# Altium project STM32G474QE开发板.PrjPcb
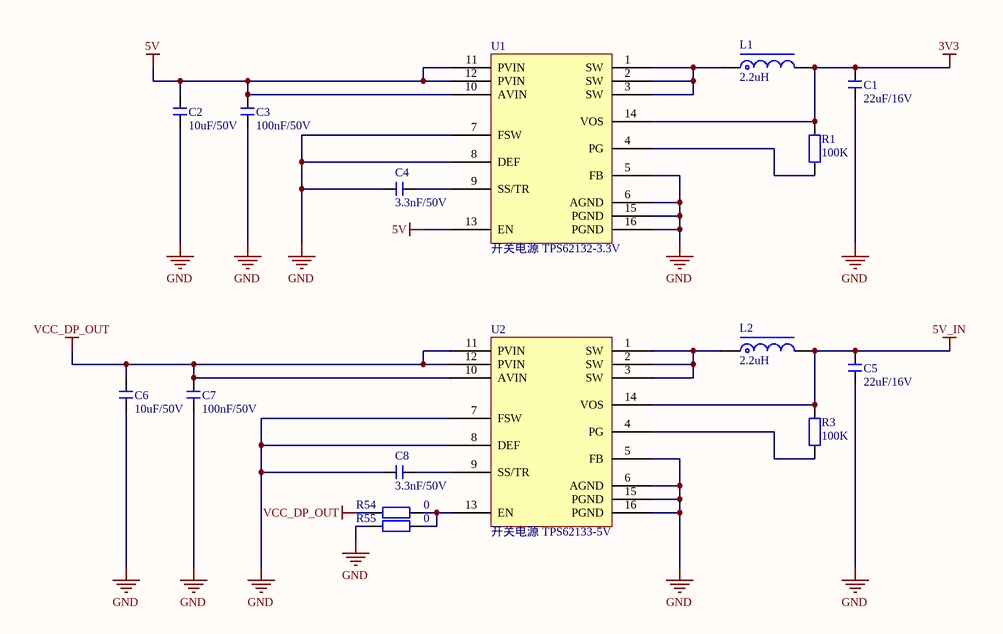
[diagram p0: POW.SchDoc]
5 sheets, 124 parts. Net scope: global (net labels, ports and power ports of the same name join across sheets).
Board file: PCB2.PcbDoc
Sheets:
  POW.SchDoc
  POW_MCU.SchDoc
  Main.SchDoc
  Debug.SchDoc
  PD_USB.SchDoc

## Sheet POW.SchDoc
size A4; SheetNumber: 1; SheetTotal: 5

### Parts
C1  22uF/16V  [C 0805_L]
C2  10uF/50V  [C 0805_L]
C3  100nF/50V  [C 0603_L]
C4  3.3nF/50V  [C 0402_L]
C5  22uF/16V  [C 0805_L]
C6  10uF/50V  [C 0805_L]
C7  100nF/50V  [C 0603_L]
C8  3.3nF/50V  [C 0402_L]
L1  2.2uH  [电感XFL4020]
L2  2.2uH  [电感XFL4020]
R1  100K  [R 0402_L]
R3  100K  [R 0402_L]
R54  0  [R 0402_L]
R55  0  [R 0402_L]
U1  开关电源 TPS62132-3.3V  [QFN16]
U2  开关电源 TPS62133-5V  [QFN16]

### Nets
3V3: C1.1 L1.2 R1.2 U1.14(VOS)
5V: C2.2 C3.2 U1.10(AVIN) U1.11(PVIN) U1.12(PVIN) U1.13(EN)
5V_IN: C5.1 L2.2 R3.1 U2.14(VOS)
GND: C1.2 C2.1 C3.1 C4.1 C5.2 C6.1 C7.1 C8.1 R55.1 U1.5(FB) U1.6(AGND) U1.7(FSW) U1.8(DEF) U1.15(PGND) U1.16(PGND) U2.5(FB) U2.6(AGND) U2.7(FSW) U2.8(DEF) U2.15(PGND) U2.16(PGND)
VCC_DP_OUT: C6.2 C7.2 R54.1 U2.10(AVIN) U2.11(PVIN) U2.12(PVIN)
NetC4_2: C4.2 U1.9(SS/TR)
NetC8_2: C8.2 U2.9(SS/TR)
NetL1_1: L1.1 U1.1(SW) U1.2(SW) U1.3(SW)
NetL2_1: L2.1 U2.1(SW) U2.2(SW) U2.3(SW)
NetR1_1: R1.1 U1.4(PG)
NetR3_2: R3.2 U2.4(PG)
NetR54_2: R54.2 R55.2 U2.13(EN)

### Library data of the parts
C1 C5 = C: 贴片电容; 主类型: 电容; 值精度: ±10%; 元件封装: 0805; 具体类型: 陶瓷电容; 封装类型: 贴片; 温度漂移: X7R（10%）; 温度范围: -55°C ~ 125°C; 生产商: SAMSUNG(三星); 生产商零件编码: CL21A226KOQNNNE; 值/型号: 22uF/16V; 立创编号: C296720
C2 C6 = C: 贴片电容; 主类型: 电容; 值精度: ±10%; 元件封装: 0805; 具体类型: 陶瓷电容; 封装类型: 贴片; 温度漂移: X5R; 温度范围: -55°C ~ 125°C; 生产商: muRata(村田); 生产商零件编码: GRM21BR61H106KE43L; 值/型号: 10uF/50V; 立创编号: C440198
C3 C7 = C: 贴片电容; 主类型: 电容; 值精度: ±10%; 元件封装: 0603; 具体类型: 陶瓷电容; 封装类型: 贴片; 温度漂移: X7R（15%）; 温度范围: -55°C ~ 125°C; 生产商: SAMSUNG(三星); 生产商零件编码: CL10B104KB8NNNC; 值/型号: 100nF/50V; 立创编号: C1590
C4 C8 = C: 贴片电容; 主类型: 电容; 值精度: ±5%; 元件封装: 0402; 具体类型: 陶瓷电容; 封装类型: 贴片; 温度漂移: X7R（5%）; 温度范围: -55°C ~ 125°C; 生产商: YAGEO(国巨); 生产商零件编码: CC0402JRX7R9BB332; 值/型号: 3.3nF/50V; 立创编号: C541447
L1 L2 = L-CD: XFL4020-222MEB; 主类型: 电感; 元件封装: 4020; 具体类型: 功率电感; 封装类型: 贴片; 温度范围: -40-125; 生产商: Coilcraft; 类型备注: 淘宝采购; 值/型号: XFL4020-222MEB; 生产商零件编码: XFL4020-222MEB; 立创编号: https://detail.tmall.com/item.htm?spm=a230r.1.14.16.717a6f292tX0SR&id=619184428761&ns=1&abbucket=12
R1 R3 = R: 贴片电阻 0402 1%; 主类型: 电阻; 元件封装: 0402; 封装类型: 贴片; 温度漂移: ±100ppm/℃; 生产商: 国巨; 生产商零件编码: RC0402FR-07100KL; 值/型号: 100K; 值精度: ±1%; 具体类型: 贴片电阻; 立创编号: C60491
R54 R55 = R: 贴片电阻; 元件封装: 0402; 封装类型: 贴片
U1 U2 = 开关电源 TPS62133: 主类型: 线性稳压器; 值/型号: TPS62133RGTR; 元件封装: VQFN-16; 具体类型: LDO; 封装类型: 贴片; 温度范围: -40-85; 生产商: TI(德州仪器); 生产商零件编码: TPS62133RGTR; 立创编号: C73973

## Sheet POW_MCU.SchDoc
size A4; SheetNumber: 2; SheetTotal: 5
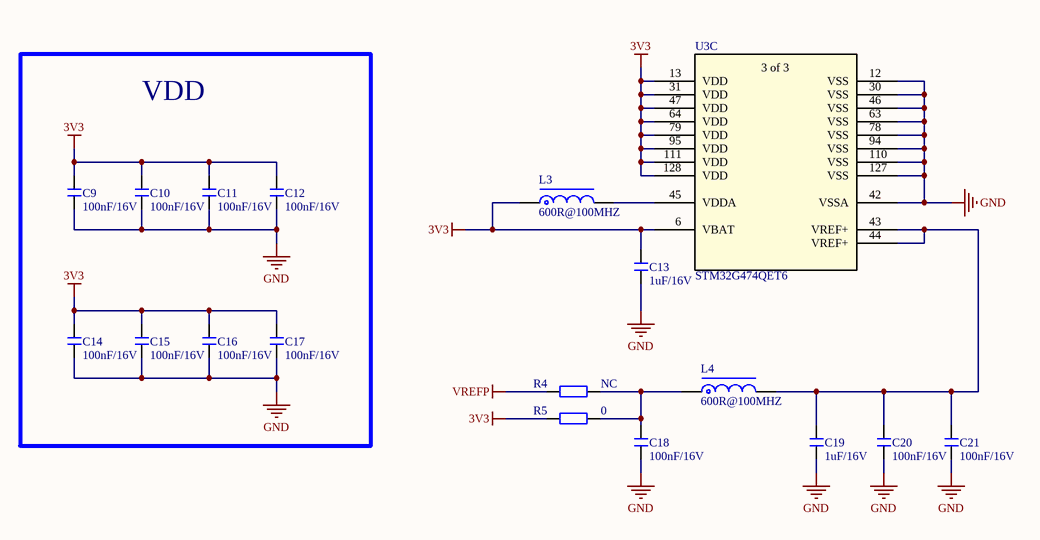
[diagram p1: POW_MCU.SchDoc]

### Parts
C9  100nF/16V  [C 0402_L]
C10  100nF/16V  [C 0402_L]
C11  100nF/16V  [C 0402_L]
C12  100nF/16V  [C 0402_L]
C13  1uF/16V  [C 0402_L]
C14  100nF/16V  [C 0402_L]
C15  100nF/16V  [C 0402_L]
C16  100nF/16V  [C 0402_L]
C17  100nF/16V  [C 0402_L]
C18  100nF/16V  [C 0402_L]
C19  1uF/16V  [C 0402_L]
C20  100nF/16V  [C 0402_L]
C21  100nF/16V  [C 0402_L]
L3  600R@100MHZ  [L 0603]
L4  600R@100MHZ  [L 0603]
R4  NC  [R 0402_L]
R5  0  [R 0402_L]
U3  STM32G474QET6  [LQFP128 14x14_L]  (part C of 3)

### Blocks framed on the sheet
VDD: C9-C12 C14-C17

### Nets
3V3: C9.2 C10.2 C11.2 C12.2 C13.1 C14.2 C15.2 C16.2 C17.2 L3.1 R5.1 U3.6(VBAT) U3.13(VDD) U3.31(VDD) U3.47(VDD) U3.64(VDD) U3.79(VDD) U3.95(VDD) U3.111(VDD) U3.128(VDD)
GND: C9.1 C10.1 C11.1 C12.1 C13.2 C14.1 C15.1 C16.1 C17.1 C18.1 C19.2 C20.1 C21.1 U3.12(VSS) U3.30(VSS) U3.42(VSSA) U3.46(VSS) U3.63(VSS) U3.78(VSS) U3.94(VSS) U3.110(VSS) U3.127(VSS)
VREFP: R4.1
NetC18_2: C18.2 L4.1 R4.2 R5.2
NetC19_1: C19.1 C20.2 C21.2 L4.2 U3.43(VREF+) U3.44(VREF+)
NetL3_2: L3.2 U3.45(VDDA)

### Notes on the sheet
- (in symbol STM32G474QET6, part C) 3 of 3

### Library data of the parts
C9-C12 C14-C18 C20 C21 = C: 贴片电容; 主类型: 电容; 值精度: ±10%; 元件封装: 0402; 具体类型: 陶瓷电容; 封装类型: 贴片; 温度漂移: X7R（15%）; 温度范围: -55°C ~ 125°C; 生产商: YAGEO(国巨); 生产商零件编码: CC0402KRX7R7BB104; 值/型号: 100nF/16V; 立创编号: C60474
C13 C19 = C: 贴片电容; 主类型: 电容; 值精度: ±10%; 元件封装: 0402; 具体类型: 陶瓷电容; 封装类型: 贴片; 温度漂移: X7R（5%）; 温度范围: -55°C ~ 125°C; 生产商: SAMSUNG(三星); 生产商零件编码: CL05A105KO5NNNC; 值/型号: 1uF/16V; 立创编号: C29266
L3 L4 = L-CD: XFL4020-222MEB; 主类型: 电感; 值/型号: FCM1608KF-601T03; 元件封装: 0603; 具体类型: 磁珠; 封装类型: 贴片; 温度范围: -40-125; 生产商: 台庆; 生产商零件编码: FCM1608KF-601T03; 立创编号: C141723
R4 R5 = R: 贴片电阻; 元件封装: 0402; 封装类型: 贴片
U3 = STM32G474QET6: No Description Available; Vendor: STMicroelectronics; Built_By: EMA_UL_Team; SourceLibrary: Updates_to_database_2020-10-19; Manufacturer_Part_Number: STM32G474QET6; Copyright: Copyright (C) 2018 Accelerated Designs. All rights reserved; RefDes: RefDes; Type: DEV

## Sheet Main.SchDoc
size A3; SheetNumber: 3; SheetTotal: 5
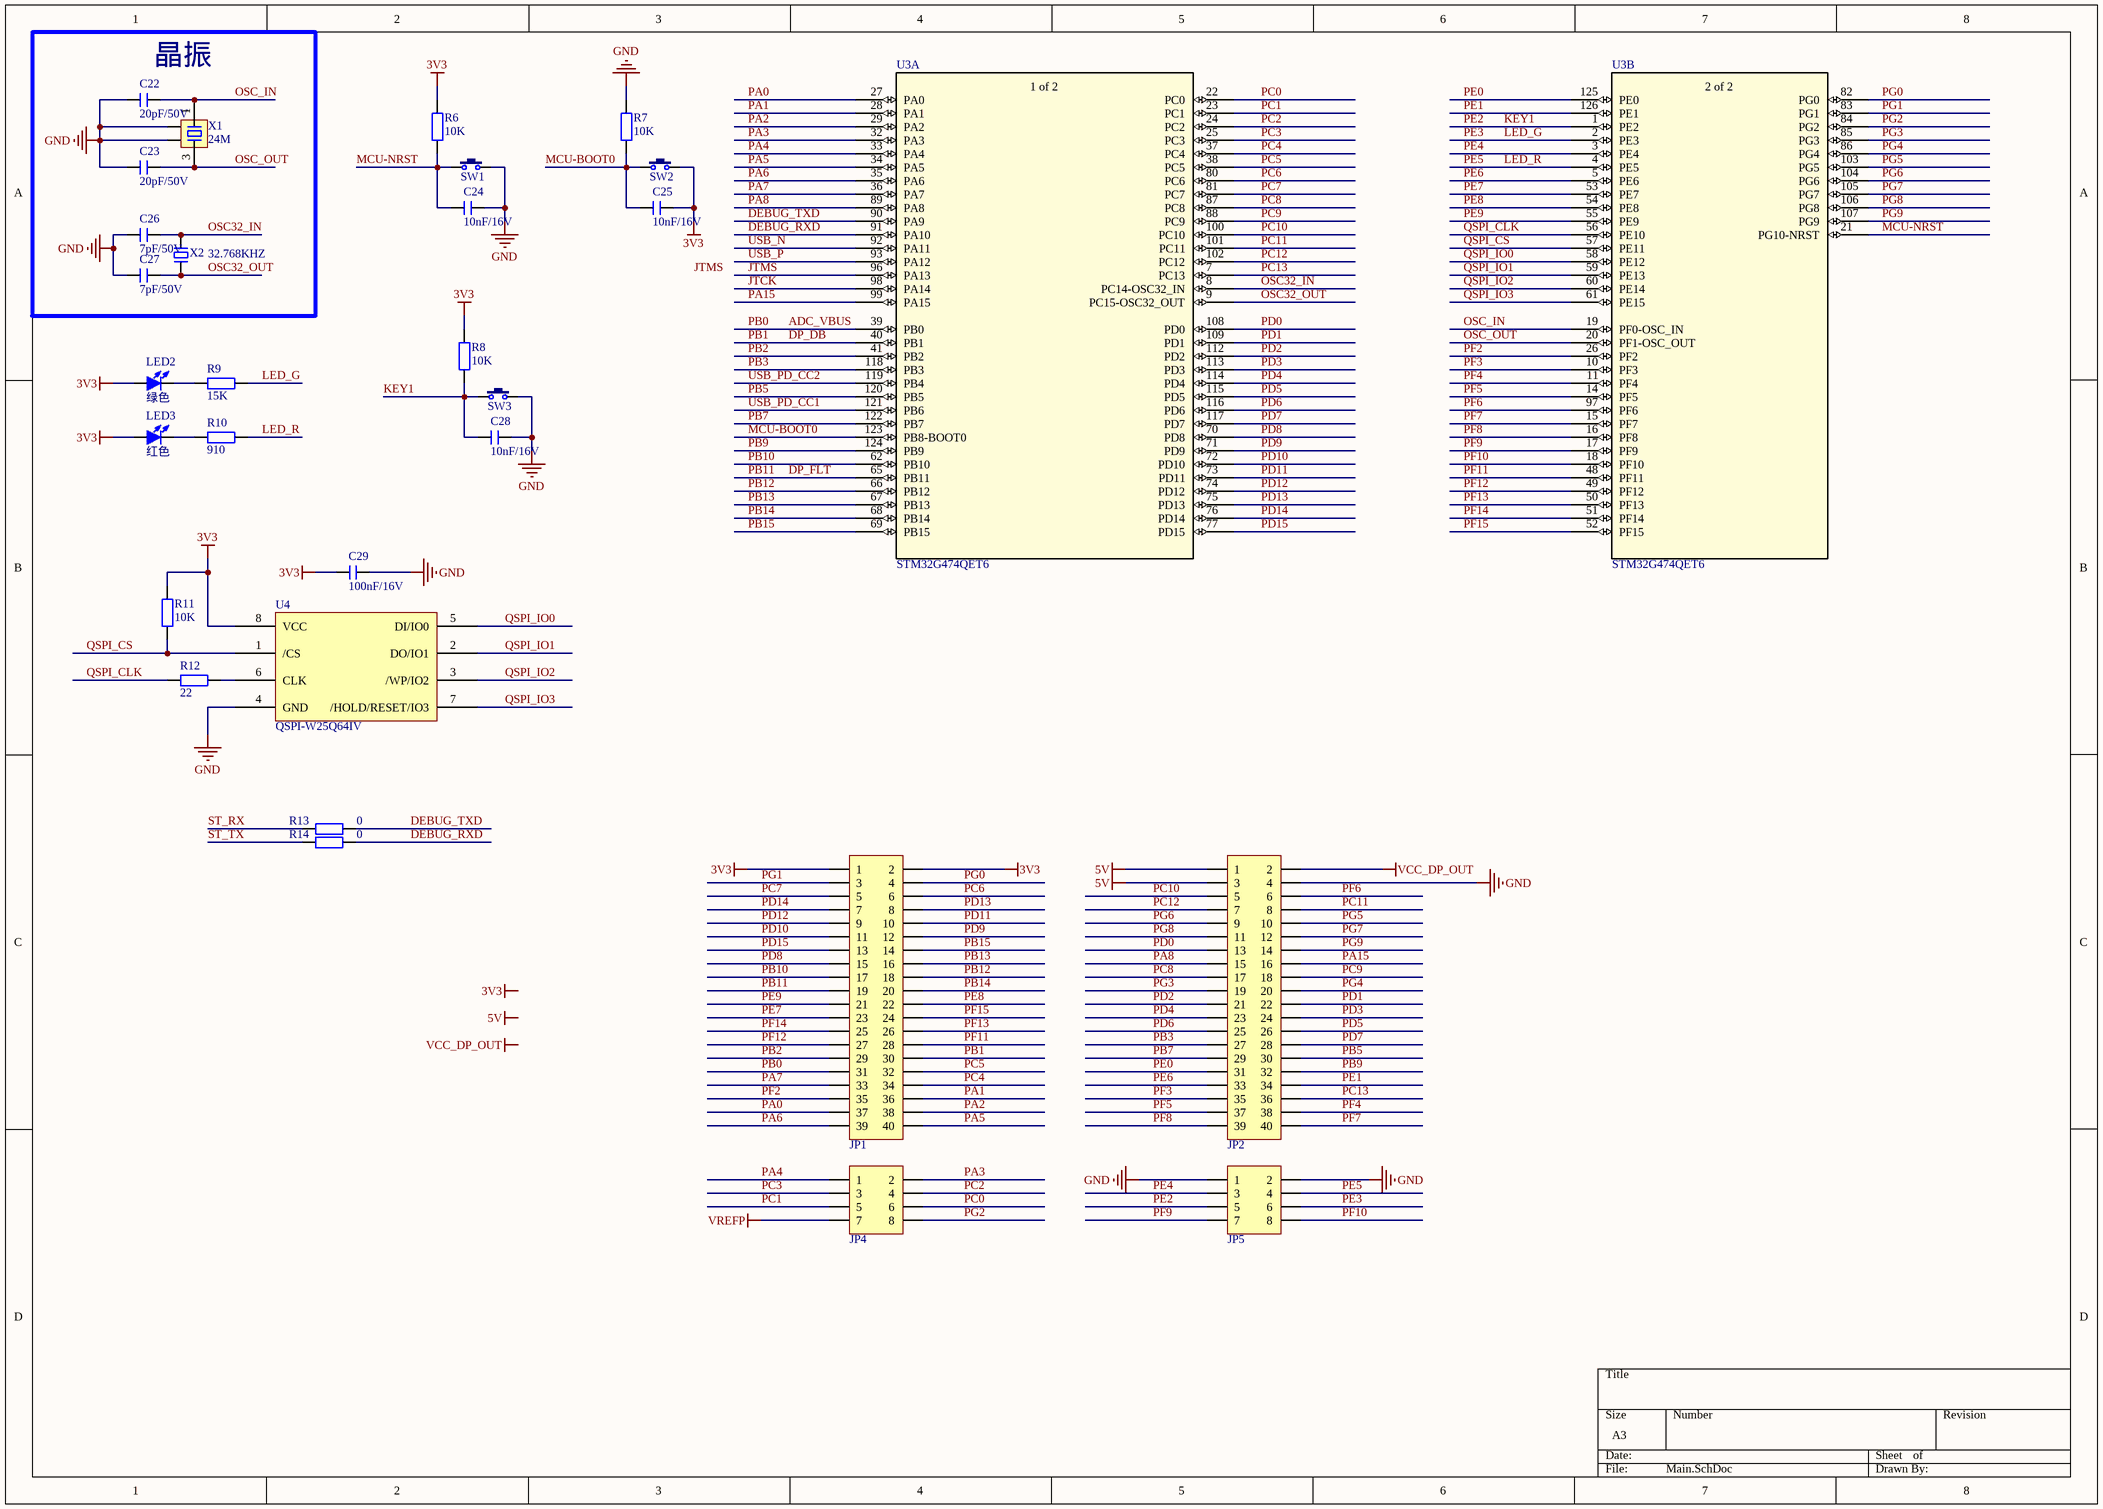
[diagram p2: Main.SchDoc]

### Parts
C22  20pF/50V  [C 0402_L]
C23  20pF/50V  [C 0402_L]
C24  10nF/16V  [C 0402_L]
C25  10nF/16V  [C 0402_L]
C26  7pF/50V  [C 0402_L]
C27  7pF/50V  [C 0402_L]
C28  10nF/16V  [C 0402_L]
C29  100nF/16V  [C 0402_L]
JP1  Header 2X11  [HDR2.54-LI-2x20P]  (value not drawn)
JP2  Header 2X11  [HDR2.54-LI-2x20P]  (value not drawn)
JP4  Header 4X2  [HDR2.54-LI-2x4P]  (value not drawn)
JP5  Header 4X2  [HDR2.54-LI-2x4P]  (value not drawn)
LED2  绿色  [LED]
LED3  红色  [LED]
R6  10K  [R 0402_L]
R7  10K  [R 0402_L]
R8  10K  [R 0402_L]
R9  15K  [R 0402_L]
R10  910  [R 0402_L]
R11  10K  [R 0402_L]
R12  22  [R 0402_L]
R13  0  [R 0402_L]
R14  0  [R 0402_L]
SW1  3x6x5  [按钮]  (value not drawn)
SW2  3x6x5  [按钮]  (value not drawn)
SW3  3x6x5  [按钮]  (value not drawn)
U3  STM32G474QET6  [LQFP128 14x14_L]  (parts A,B of 3)
U4  QSPI-W25Q64IV  [QSPI]
X1  24M  [OSC 3225-4P]
X2  32.768KHZ  [OSC 3215-2P]

### Blocks framed on the sheet
晶振: C22 C23 C26 C27 X1 X2

### Nets
3V3: C25.2 C29.2 JP1.1 JP1.2 LED2.1(A) LED3.1(A) R6.2 R8.2 R11.1 SW2.2 U4.8(VCC)
5V: JP2.1 JP2.3
GND: C22.1 C23.1 C24.2 C26.1 C27.1 C28.2 C29.1 JP2.4 JP5.1 JP5.2 R7.2 SW1.2 SW3.2 U4.4(GND) X1.2 X1.4
VCC_DP_OUT: JP2.2
VREFP: JP4.7
ADC_VBUS: JP1.31 U3.39(PB0)  [also labelled PB0]
DEBUG_RXD: R14.2 U3.91(PA10)
DEBUG_TXD: R13.2 U3.90(PA9)
DP_DB: JP1.30 U3.40(PB1)  [also labelled PB1]
DP_FLT: JP1.19 U3.65(PB11)  [also labelled PB11]
JTCK: U3.98(PA14)
JTMS: U3.96(PA13)
KEY1: C28.1 JP5.5 R8.1 SW3.1 U3.1(PE2)  [also labelled PE2]
LED_G: JP5.6 R9.1 U3.2(PE3)  [also labelled PE3]
LED_R: JP5.4 R10.1 U3.4(PE5)  [also labelled PE5]
MCU-BOOT0: C25.1 R7.1 SW2.1 U3.123(PB8-BOOT0)
MCU-NRST: C24.1 R6.1 SW1.1 U3.21(PG10-NRST)
OSC32_IN: C26.2 U3.8(PC14-OSC32_IN) X2.2
OSC32_OUT: C27.2 U3.9(PC15-OSC32_OUT) X2.1
OSC_IN: C22.2 U3.19(PF0-OSC_IN) X1.1
OSC_OUT: C23.2 U3.20(PF1-OSC_OUT) X1.3
PA0: JP1.37 U3.27(PA0)
PA1: JP1.36 U3.28(PA1)
PA2: JP1.38 U3.29(PA2)
PA3: JP4.2 U3.32(PA3)
PA4: JP4.1 U3.33(PA4)
PA5: JP1.40 U3.34(PA5)
PA6: JP1.39 U3.35(PA6)
PA7: JP1.33 U3.36(PA7)
PA8: JP2.15 U3.89(PA8)
PA15: JP2.16 U3.99(PA15)
PB2: JP1.29 U3.41(PB2)
PB3: JP2.27 U3.118(PB3)
PB5: JP2.30 U3.120(PB5)
PB7: JP2.29 U3.122(PB7)
PB9: JP2.32 U3.124(PB9)
PB10: JP1.17 U3.62(PB10)
PB12: JP1.18 U3.66(PB12)
PB13: JP1.16 U3.67(PB13)
PB14: JP1.20 U3.68(PB14)
PB15: JP1.14 U3.69(PB15)
PC0: JP4.6 U3.22(PC0)
PC1: JP4.5 U3.23(PC1)
PC2: JP4.4 U3.24(PC2)
PC3: JP4.3 U3.25(PC3)
PC4: JP1.34 U3.37(PC4)
PC5: JP1.32 U3.38(PC5)
PC6: JP1.6 U3.80(PC6)
PC7: JP1.5 U3.81(PC7)
PC8: JP2.17 U3.87(PC8)
PC9: JP2.18 U3.88(PC9)
PC10: JP2.5 U3.100(PC10)
PC11: JP2.8 U3.101(PC11)
PC12: JP2.7 U3.102(PC12)
PC13: JP2.36 U3.7(PC13)
PD0: JP2.13 U3.108(PD0)
PD1: JP2.22 U3.109(PD1)
PD2: JP2.21 U3.112(PD2)
PD3: JP2.24 U3.113(PD3)
PD4: JP2.23 U3.114(PD4)
PD5: JP2.26 U3.115(PD5)
PD6: JP2.25 U3.116(PD6)
PD7: JP2.28 U3.117(PD7)
PD8: JP1.15 U3.70(PD8)
PD9: JP1.12 U3.71(PD9)
PD10: JP1.11 U3.72(PD10)
PD11: JP1.10 U3.73(PD11)
PD12: JP1.9 U3.74(PD12)
PD13: JP1.8 U3.75(PD13)
PD14: JP1.7 U3.76(PD14)
PD15: JP1.13 U3.77(PD15)
PE0: JP2.31 U3.125(PE0)
PE1: JP2.34 U3.126(PE1)
PE4: JP5.3 U3.3(PE4)
PE6: JP2.33 U3.5(PE6)
PE7: JP1.23 U3.53(PE7)
PE8: JP1.22 U3.54(PE8)
PE9: JP1.21 U3.55(PE9)
PF2: JP1.35 U3.26(PF2)
PF3: JP2.35 U3.10(PF3)
PF4: JP2.38 U3.11(PF4)
PF5: JP2.37 U3.14(PF5)
PF6: JP2.6 U3.97(PF6)
PF7: JP2.40 U3.15(PF7)
PF8: JP2.39 U3.16(PF8)
PF9: JP5.7 U3.17(PF9)
PF10: JP5.8 U3.18(PF10)
PF11: JP1.28 U3.48(PF11)
PF12: JP1.27 U3.49(PF12)
PF13: JP1.26 U3.50(PF13)
PF14: JP1.25 U3.51(PF14)
PF15: JP1.24 U3.52(PF15)
PG0: JP1.4 U3.82(PG0)
PG1: JP1.3 U3.83(PG1)
PG2: JP4.8 U3.84(PG2)
PG3: JP2.19 U3.85(PG3)
PG4: JP2.20 U3.86(PG4)
PG5: JP2.10 U3.103(PG5)
PG6: JP2.9 U3.104(PG6)
PG7: JP2.12 U3.105(PG7)
PG8: JP2.11 U3.106(PG8)
PG9: JP2.14 U3.107(PG9)
QSPI_CLK: R12.1 U3.56(PE10)
QSPI_CS: R11.2 U3.57(PE11) U4.1(/CS)
QSPI_IO0: U3.58(PE12) U4.5(DI/IO0)
QSPI_IO1: U3.59(PE13) U4.2(DO/IO1)
QSPI_IO2: U3.60(PE14) U4.3(/WP/IO2)
QSPI_IO3: U3.61(PE15) U4.7(/HOLD/RESET/IO3)
ST_RX: R13.1
ST_TX: R14.1
USB_N: U3.92(PA11)
USB_P: U3.93(PA12)
USB_PD_CC1: U3.121(PB6)
USB_PD_CC2: U3.119(PB4)
NetLED2_2: LED2.2(K) R9.2
NetLED3_2: LED3.2(K) R10.2
NetR12_2: R12.2 U4.6(CLK)

### Notes on the sheet
- Labels drawn without touching a wire or pin: 3V3, 5V, JTMS, VCC_DP_OUT
- (in symbol STM32G474QET6, part A) 1 of 2
- (in symbol STM32G474QET6, part B) 2 of 2

### Library data of the parts
C22 C23 = C: 贴片电容; 主类型: 电容; 值精度: ±1%; 元件封装: 0402; 具体类型: 陶瓷电容; 封装类型: 贴片; 温度漂移: NP0; 生产商: YAGEO(国巨); 生产商零件编码: CC0402FRNPO9BN200; 值/型号: 20pF/50V; 立创编号: C327010
C24 C25 C28 = C: 贴片电容; 主类型: 电容; 值精度: ±10%; 元件封装: 0402; 具体类型: 陶瓷电容; 封装类型: 贴片; 温度漂移: X7R; 生产商: YAGEO(国巨); 生产商零件编码: CC0402KRX7R7BB103; 值/型号: 10nF/16V; 立创编号: C327009
C26 C27 = C: 贴片电容; 主类型: 电容; 值精度: ±0.25pF; 元件封装: 0402; 具体类型: 陶瓷电容; 封装类型: 贴片; 温度漂移: C0G; 生产商: YAGEO(国巨); 生产商零件编码: CC0402CRNPO9BN7R0; 值/型号: 7pF/50V; 立创编号: C260628
C29 = C: as C9 on sheet POW_MCU; 值/型号: 100nF/16V; 立创编号: C60474
JP1 JP2 = Header 20X2: 20*2P接插件; 版权归属: 源创客; BOM名称: 20*2P接插件; 学习资源: www.ooocke.com
JP4 JP5 = Header 4X2: 4*2P接插件; 版权归属: 源创客; BOM名称: 4*2P接插件; 学习资源: www.ooocke.com
LED2 LED3 = LED-SMD: C84267
R6-R8 = R: 贴片电阻
R9 = R: 贴片电阻 0402 5%; 主类型: 电阻; 值精度: ±1%; 元件封装: 0402; 封装类型: 贴片; 温度漂移: 50ppm; 生产商: 国巨; 生产商零件编码: RT0402FRE0715KL; 值/型号: 15K; 具体类型: 贴片电阻; 立创编号: C136975
R10 = R: 贴片电阻 0402 5%; 主类型: 电阻; 值/型号: 15K; 值精度: ±1%; 元件封装: 0402; 封装类型: 贴片; 温度漂移: 50ppm; 生产商: 国巨; 生产商零件编码: RT0402FRE0715KL; 具体类型: 贴片电阻; 立创编号: C136975
R11 R12 = R: 贴片电阻 0402 1%; 主类型: 电阻; 值/型号: 100K; 元件封装: 0402; 封装类型: 贴片; 温度漂移: ±100ppm/℃; 生产商: 国巨; 生产商零件编码: RC0402FR-07100KL; 值精度: ±1%; 具体类型: 贴片电阻; 立创编号: C60491
R13 R14 = R: 贴片电阻; 元件封装: 0402; 封装类型: 贴片
SW1-SW3 = TSW 3x6: 3x6轻触开关
U3 = STM32G474QET6: as U3 on sheet POW_MCU; Manufacturer_Part_Number: STM32G474QET6; Copyright: Copyright (C) 2018 Accelerated Designs. All rights reserved; RefDes: RefDes; Type: DEV
U4 = QSPI-W25Q256IV
X1 = XTAL-4P: 4脚无源晶振; 主类型: 晶振; 值精度: 20PPM; 元件封装: 3225; 具体类型: 无源晶振; 封装类型: 贴片; 温度范围: -40℃~85℃; 生产商: YXC扬兴科技; 生产商零件编码: X322524MSB4SI; 值/型号: 24M; 立创编号: C15643
X2 = XTAL-2P: 2脚无源脚晶振; 主类型: 晶振; 值精度: 10PPM; 元件封装: 3215; 具体类型: 无源晶振; 封装类型: 贴片; 温度范围: -40℃ ~ +85℃; 生产商: EPSON(爱普生); 生产商零件编码: Q13FC1350000200; 值/型号: 32.768K; 立创编号: C48615

## Sheet Debug.SchDoc
size A3; SheetNumber: 4; SheetTotal: 5
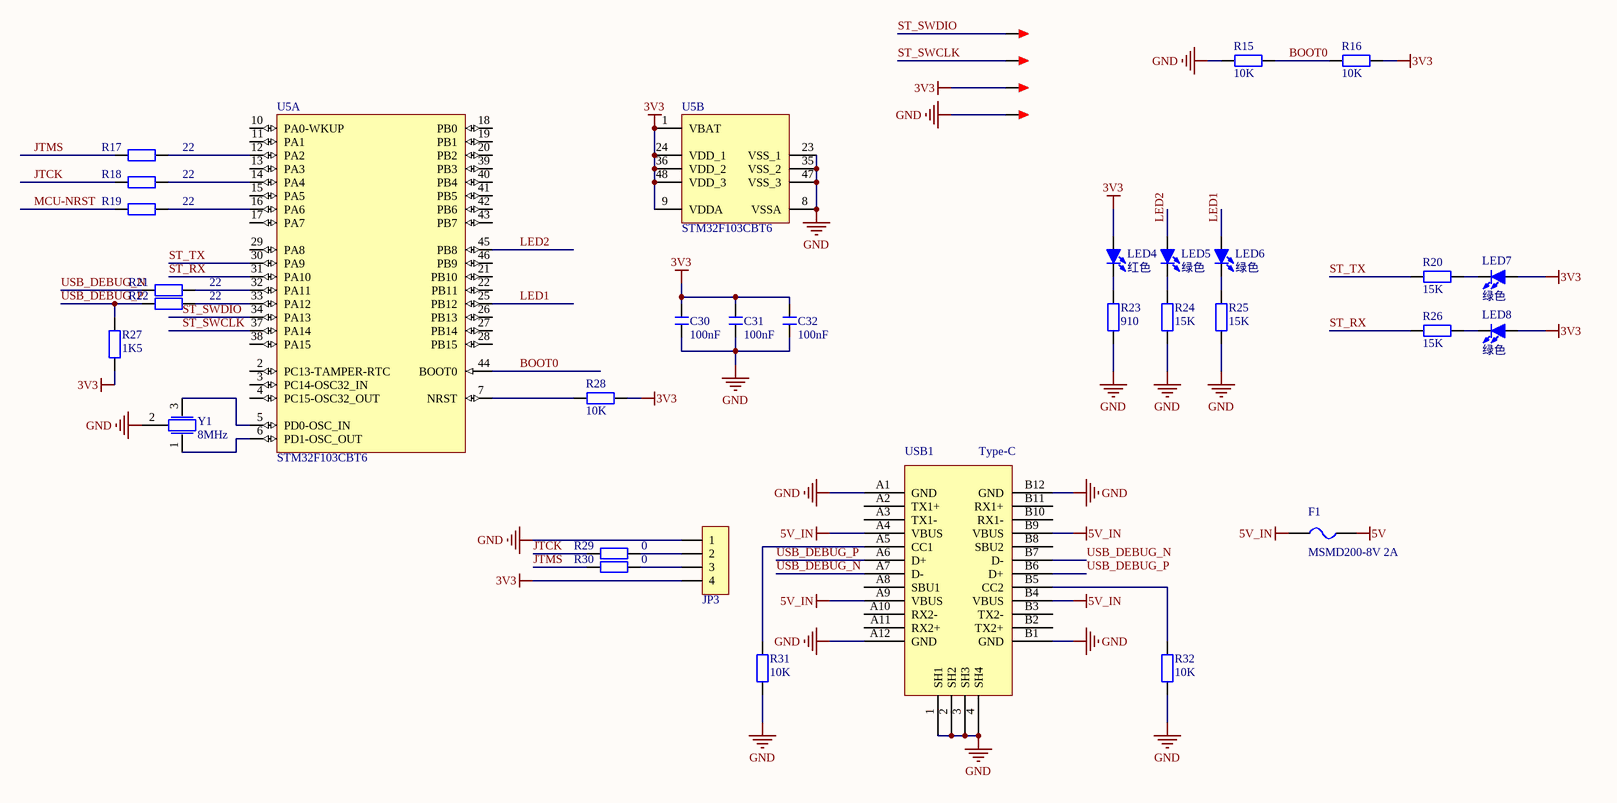
[diagram p3: Debug.SchDoc]

### Parts
C30  100nF  [C 0402_L]
C31  100nF  [C 0402_L]
C32  100nF  [C 0402_L]
F1  MSMD200-8V 2A  [FU 0603]
JP3  HDR-1X4  [HDR2.54-WI-4P]  (value not drawn)
LED4  红色  [LED]
LED5  绿色  [LED]
LED6  绿色  [LED]
LED7  绿色  [LED]
LED8  绿色  [LED]
R15  10K  [R 0402_L]
R16  10K  [R 0402_L]
R17  22  [R 0402_L]
R18  22  [R 0402_L]
R19  22  [R 0402_L]
R20  15K  [R 0402_L]
R21  22  [R 0402_L]
R22  22  [R 0402_L]
R23  910  [R 0402_L]
R24  15K  [R 0402_L]
R25  15K  [R 0402_L]
R26  15K  [R 0402_L]
R27  1K5  [R 0402_L]
R28  10K  [R 0402_L]
R29  0  [R 0402_L]
R30  0  [R 0402_L]
R31  10K  [R 0402_L]
R32  10K  [R 0402_L]
TP1  TEST  [TEST 1.2]  (value not drawn)
TP2  TEST  [TEST 1.2]  (value not drawn)
TP3  TEST  [TEST 1.2]  (value not drawn)
TP4  TEST  [TEST 1.2]  (value not drawn)
U5  STM32F103CBT6  [LQFP48-7*7]  (parts A,B of 2)
USB1  Type-C  [Type-c接口]
Y1  8MHz  [三脚晶振]

### Nets
3V3: C30.2 C31.2 C32.2 JP3.4 LED4.1(A) LED7.1(A) LED8.1(A) R16.1 R27.2 R28.1 TP3.1 U5.1(VBAT) U5.9(VDDA) U5.24(VDD_1) U5.36(VDD_2) U5.48(VDD_3)
5V: F1.2
5V_IN: F1.1 USB1.A4(VBUS) USB1.A9(VBUS) USB1.B4(VBUS) USB1.B9(VBUS)
GND: C30.1 C31.1 C32.1 JP3.1 R15.1 R23.1 R24.1 R25.1 R31.1 R32.1 TP4.1 U5.8(VSSA) U5.23(VSS_1) U5.35(VSS_2) U5.47(VSS_3) USB1.1(SH1) USB1.2(SH2) USB1.3(SH3) USB1.4(SH4) USB1.A1(GND) USB1.A12(GND) USB1.B1(GND) USB1.B12(GND) Y1.2
BOOT0: R15.2 R16.2 U5.44(BOOT0)
JTCK: R18.2 R29.1
JTMS: R17.2 R30.1
LED1: LED6.1(A) U5.25(PB12)
LED2: LED5.1(A) U5.45(PB8)
MCU-NRST: R19.2
ST_RX: R26.1 U5.31(PA10)
ST_SWCLK: TP2.1 U5.37(PA14)
ST_SWDIO: TP1.1 U5.34(PA13)
ST_TX: R20.1 U5.30(PA9)
USB_DEBUG_N: R21.2 USB1.A7(D-) USB1.B7(D-)
USB_DEBUG_P: R22.2 R27.1 USB1.A6(D+) USB1.B6(D+)
NetJP3_2: JP3.2 R29.2
NetJP3_3: JP3.3 R30.2
NetLED4_2: LED4.2(K) R23.2
NetLED5_2: LED5.2(K) R24.2
NetLED6_2: LED6.2(K) R25.2
NetLED7_2: LED7.2(K) R20.2
NetLED8_2: LED8.2(K) R26.2
NetR17_1: R17.1 U5.12(PA2)
NetR18_1: R18.1 U5.14(PA4)
NetR19_1: R19.1 U5.16(PA6)
NetR21_1: R21.1 U5.32(PA11)
NetR22_1: R22.1 U5.33(PA12)
NetR28_2: R28.2 U5.7(NRST)
NetR31_2: R31.2 USB1.A5(CC1)
NetR32_2: R32.2 USB1.B5(CC2)
NetU5_5: U5.5(PD0-OSC_IN) Y1.3
NetU5_6: U5.6(PD1-OSC_OUT) Y1.1

Not connected (* = marked no-connect by the designer): U5 2(PC13-TAMPER-RTC) 3(PC14-OSC32_IN) 4(PC15-OSC32_OUT) 10(PA0-WKUP) 11(PA1) 13(PA3) 15(PA5) 17(PA7) 18(PB0) 19(PB1) 20(PB2) 21(PB10) 22(PB11) 26(PB13) 27(PB14) 28(PB15) 29(PA8) 38(PA15) 39(PB3) 40(PB4) 41(PB5) 42(PB6) 43(PB7) 46(PB9); USB1 A2(TX1+) A3(TX1-) A8(SBU1) A10(RX2-) A11(RX2+) B2(TX2+) B3(TX2-) B8(SBU2) B10(RX1-) B11(RX1+)

### Library data of the parts
C30-C32 = C: 贴片电容; 主类型: 电容; 值/型号: 7pF/50V; 值精度: ±0.25pF; 元件封装: 0402; 具体类型: 陶瓷电容; 封装类型: 贴片; 温度漂移: C0G; 生产商: FH(风华); 生产商零件编码: 0402CG7R0C500NT; 立创编号: C1577
F1 = FU: 贴片保险丝
JP3 = Header 4: 4P接插件
LED4-LED8 = LED-SMD: C84267
R15-R19 R21 R22 R27 R28 R31 R32 = R: 贴片电阻
R20 R24-R26 = R: as R9 on sheet Main; 值/型号: 15K; 具体类型: 贴片电阻; 立创编号: C136975
R23 = R: as R10 on sheet Main; 具体类型: 贴片电阻; 立创编号: C136975
R29 R30 = R: 贴片电阻; 元件封装: 0402; 封装类型: 贴片
TP1-TP4 = TEST: 测试点
U5 = STM32F103CBT6: ARM Cortex-M3 32-bit MCU, 128 KB Flash, 20 KB Internal RAM, 37 I/Os, 48-pin LQFP, -40 to 85 degC, Tray
USB1 = USB-Type-C-TOP
Y1 = 晶振-3Pin: 村田贴片

## Sheet PD_USB.SchDoc
size A4; SheetNumber: 5; SheetTotal: 5
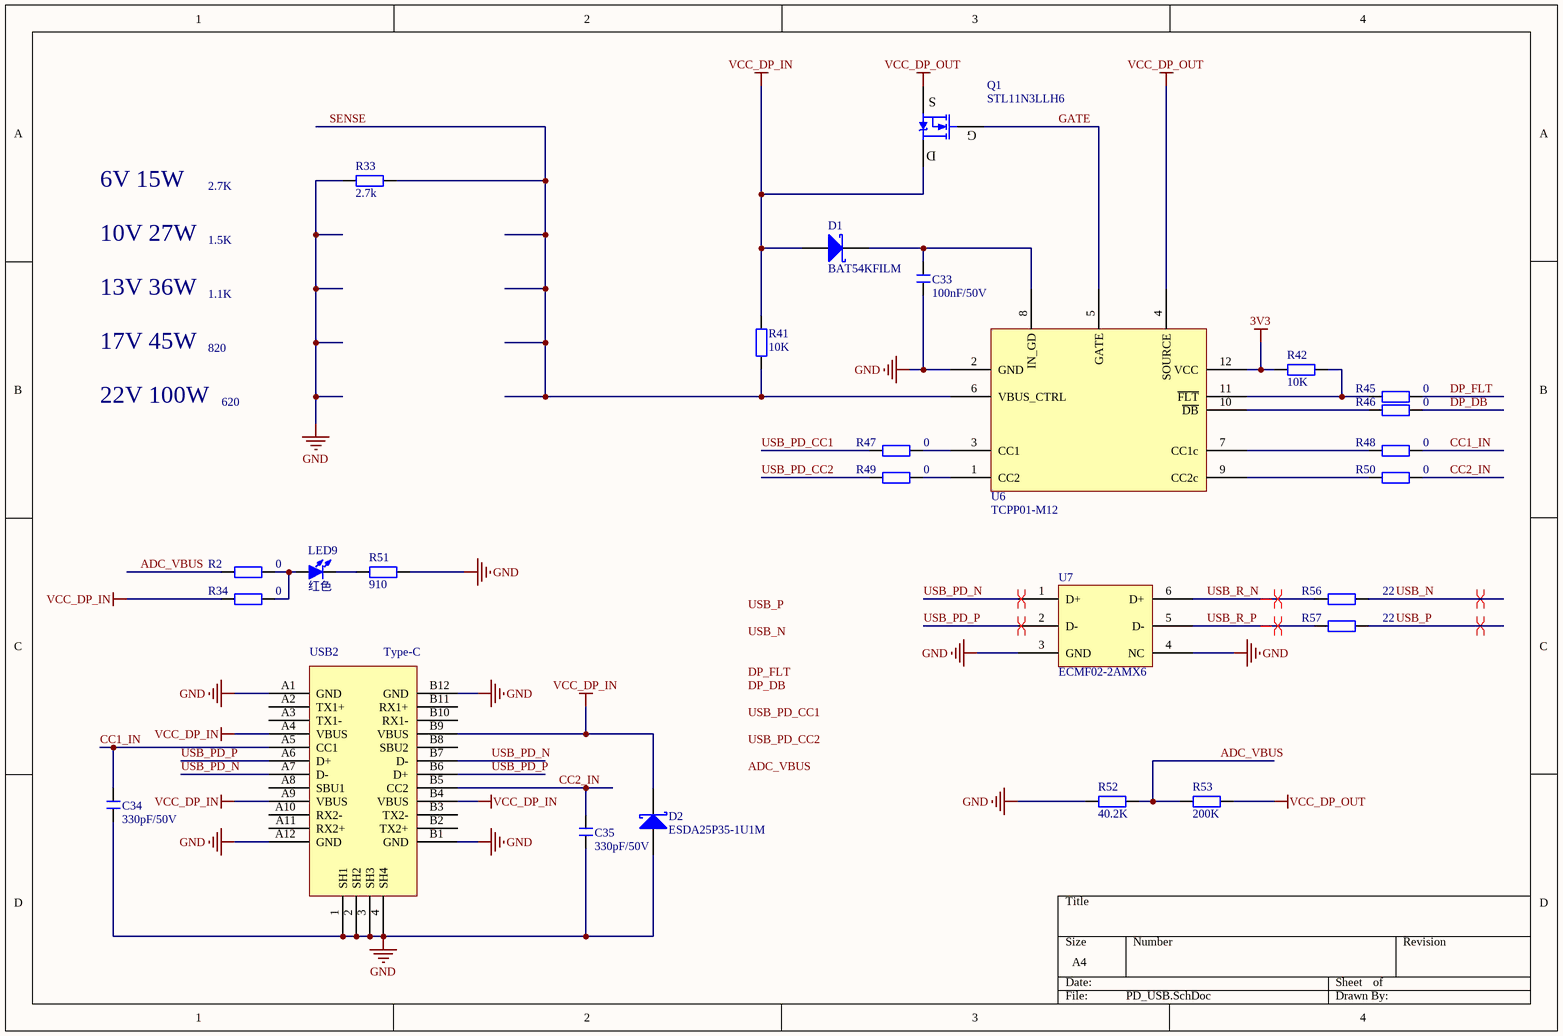
[diagram p4: PD_USB.SchDoc]

### Parts
C33  100nF/50V  [C 0402_L]
C34  330pF/50V  [C 0402_L]
C35  330pF/50V  [C 0402_L]
D1  BAT54KFILM  [BAT54KFILM]
D2  ESDA25P35-1U1M  [ESDA25P35-1U1M]
LED9  红色  [LED]
Q1  STL11N3LLH6  [STL11N3LLH6]
R2  0  [R 0402_L]
R33  2.7k  [R 0402_L]
R34  0  [R 0402_L]
R41  10K  [R 0402_L]
R42  10K  [R 0402_L]
R45  0  [R 0402_L]
R46  0  [R 0402_L]
R47  0  [R 0402_L]
R48  0  [R 0402_L]
R49  0  [R 0402_L]
R50  0  [R 0402_L]
R51  910  [R 0402_L]
R52  40.2K  [R 0402_L]
R53  200K  [R 0402_L]
R56  22  [R 0402_L]
R57  22  [R 0402_L]
U6  TCPP01-M12  [TCPP01-M12]
U7  ECMF02-2AMX6  [ECMF02-2AMX6]
USB2  Type-C  [Type-c接口]

### Nets
3V3: R42.2 U6.12(VCC)
GND: C33.1 C34.1 C35.1 D2.1(A) R33.1 R51.1 R52.2 U6.2(GND) U7.3(GND) U7.4(NC) USB2.1(SH1) USB2.2(SH2) USB2.3(SH3) USB2.4(SH4) USB2.A1(GND) USB2.A12(GND) USB2.B1(GND) USB2.B12(GND)
VCC_DP_IN: D1.1(A) D2.2(K) Q1.3(D) R34.1 R41.2 USB2.A4(VBUS) USB2.A9(VBUS) USB2.B4(VBUS) USB2.B9(VBUS)
VCC_DP_OUT: Q1.2(S) R53.1 U6.4(SOURCE)
ADC_VBUS: R2.1 R52.1 R53.2
CC1_IN: C34.2 R48.2 USB2.A5(CC1)
CC2_IN: C35.2 R50.2 USB2.B5(CC2)
DP_DB: R46.2
DP_FLT: R45.2
GATE: Q1.1(G) U6.5(GATE)
SENSE: R33.2 R41.1 U6.6(VBUS_CTRL)
USB_N: R56.1
USB_P: R57.1
USB_PD_CC1: R47.1
USB_PD_CC2: R49.1
USB_PD_N: U7.1(D+) USB2.A7(D-) USB2.B7(D-)
USB_PD_P: U7.2(D-) USB2.A6(D+) USB2.B6(D+)
USB_R_N: R56.2 U7.6(D+)
USB_R_P: R57.2 U7.5(D-)
NetC33_2: C33.2 D1.2(K) U6.8(IN_GD)
NetLED9_1: LED9.1(A) R2.2 R34.2
NetLED9_2: LED9.2(K) R51.2
NetR42_1: R42.1 R45.1 U6.11(~{FLT})
NetR46_1: R46.1 U6.10(~{DB})
NetR47_2: R47.2 U6.3(CC1)
NetR48_1: R48.1 U6.7(CC1c)
NetR49_2: R49.2 U6.1(CC2)
NetR50_1: R50.1 U6.9(CC2c)

Not connected (* = marked no-connect by the designer): USB2 A2(TX1+) A3(TX1-) A8(SBU1) A10(RX2-) A11(RX2+) B2(TX2+) B3(TX2-) B8(SBU2) B10(RX1-) B11(RX1+)

### Layout directives
differential pair: USB_N, USB_P, USB_PD_N, USB_PD_P, USB_R_N, USB_R_P

### Notes on the sheet
- 6V 15W
- 10V 27W
- 2.7K
- 1.5K
- 13V 36W
- 1.1K
- 17V 45W
- 820
- 22V 100W
- 620
- Labels drawn without touching a wire or pin: ADC_VBUS, DP_DB, DP_FLT, USB_N, USB_P, USB_PD_CC1, USB_PD_CC2

### Library data of the parts
C33 = C: as C3 on sheet POW; 值/型号: 100nF/50V; 立创编号: C1590
C34 C35 = C: 贴片电容; 主类型: 电容; 值精度: ±10%; 元件封装: 0402; 具体类型: 陶瓷电容; 封装类型: 贴片; 温度漂移: X7R（15%）; 温度范围: -55°C ~ 125°C; 生产商: YAGEO(国巨); 生产商零件编码: CC0402KRX7R9BB331; 值/型号: 330pF/50V; 立创编号: C106206
D1 = D Schottky: Schottky Diode; 主类型: 二极管; 元件封装: SOD-523; 具体类型: 肖特基二极管; 封装类型: 贴片; 生产商: ST(意法半导体); 值/型号: BAT54KFILM; 生产商零件编码: BAT54KFILM; 立创编号: C283259
D2 = D Schottky: Schottky Diode
LED9 = LED-SMD: C84267
Q1 = SI2302: N沟道场效应管
R2 R33 R34 R45-R50 R52 R53 = R: 贴片电阻; 元件封装: 0402; 封装类型: 贴片
R41 R42 R56 R57 = R: 贴片电阻
R51 = R: as R10 on sheet Main; 具体类型: 贴片电阻; 立创编号: C136975
USB2 = USB-Type-C-TOP

## Nets that join several sheets
3V3: POW (C1.1 L1.2 R1.2 U1.14), POW_MCU (20 pins), Main (11 pins), Debug (16 pins), PD_USB (R42.2 U6.12)
5V: POW (6 pins), Main (JP2.1 JP2.3), Debug (F1.2)
5V_IN: POW (C5.1 L2.2 R3.1 U2.14), Debug (5 pins)
GND: POW (21 pins), POW_MCU (22 pins), Main (16 pins), Debug (24 pins), PD_USB (18 pins)
VCC_DP_OUT: POW (6 pins), Main (JP2.2), PD_USB (Q1.2 R53.1 U6.4)
VREFP: POW_MCU (R4.1), Main (JP4.7)
ADC_VBUS: Main (JP1.31 U3.39), PD_USB (R2.1 R52.1 R53.2)
DP_DB: Main (JP1.30 U3.40), PD_USB (R46.2)
DP_FLT: Main (JP1.19 U3.65), PD_USB (R45.2)
JTCK: Main (U3.98), Debug (R18.2 R29.1)
JTMS: Main (U3.96), Debug (R17.2 R30.1)
MCU-NRST: Main (C24.1 R6.1 SW1.1 U3.21), Debug (R19.2)
ST_RX: Main (R13.1), Debug (R26.1 U5.31)
ST_TX: Main (R14.1), Debug (R20.1 U5.30)
USB_N: Main (U3.92), PD_USB (R56.1)
USB_P: Main (U3.93), PD_USB (R57.1)
USB_PD_CC1: Main (U3.121), PD_USB (R47.1)
USB_PD_CC2: Main (U3.119), PD_USB (R49.1)